# Altium schematic sheet Spanungsversorgung.SchDoc: SysP18_Team10: Spannungsregler
size A4; Author: Michael Alig; CompanyName: NTB; Organization: NTB Interstate University of Applied; Address1: Werdenbergstrasse 4; Address3: 9471 Buchs; Address4: Switzerland; SheetNumber: 2; SheetTotal: 5; Organization1: Sciences of Technology Buchs; Size: A4; ShortDescription: Schema Spannungsregler 3.3V, 5V, 12V
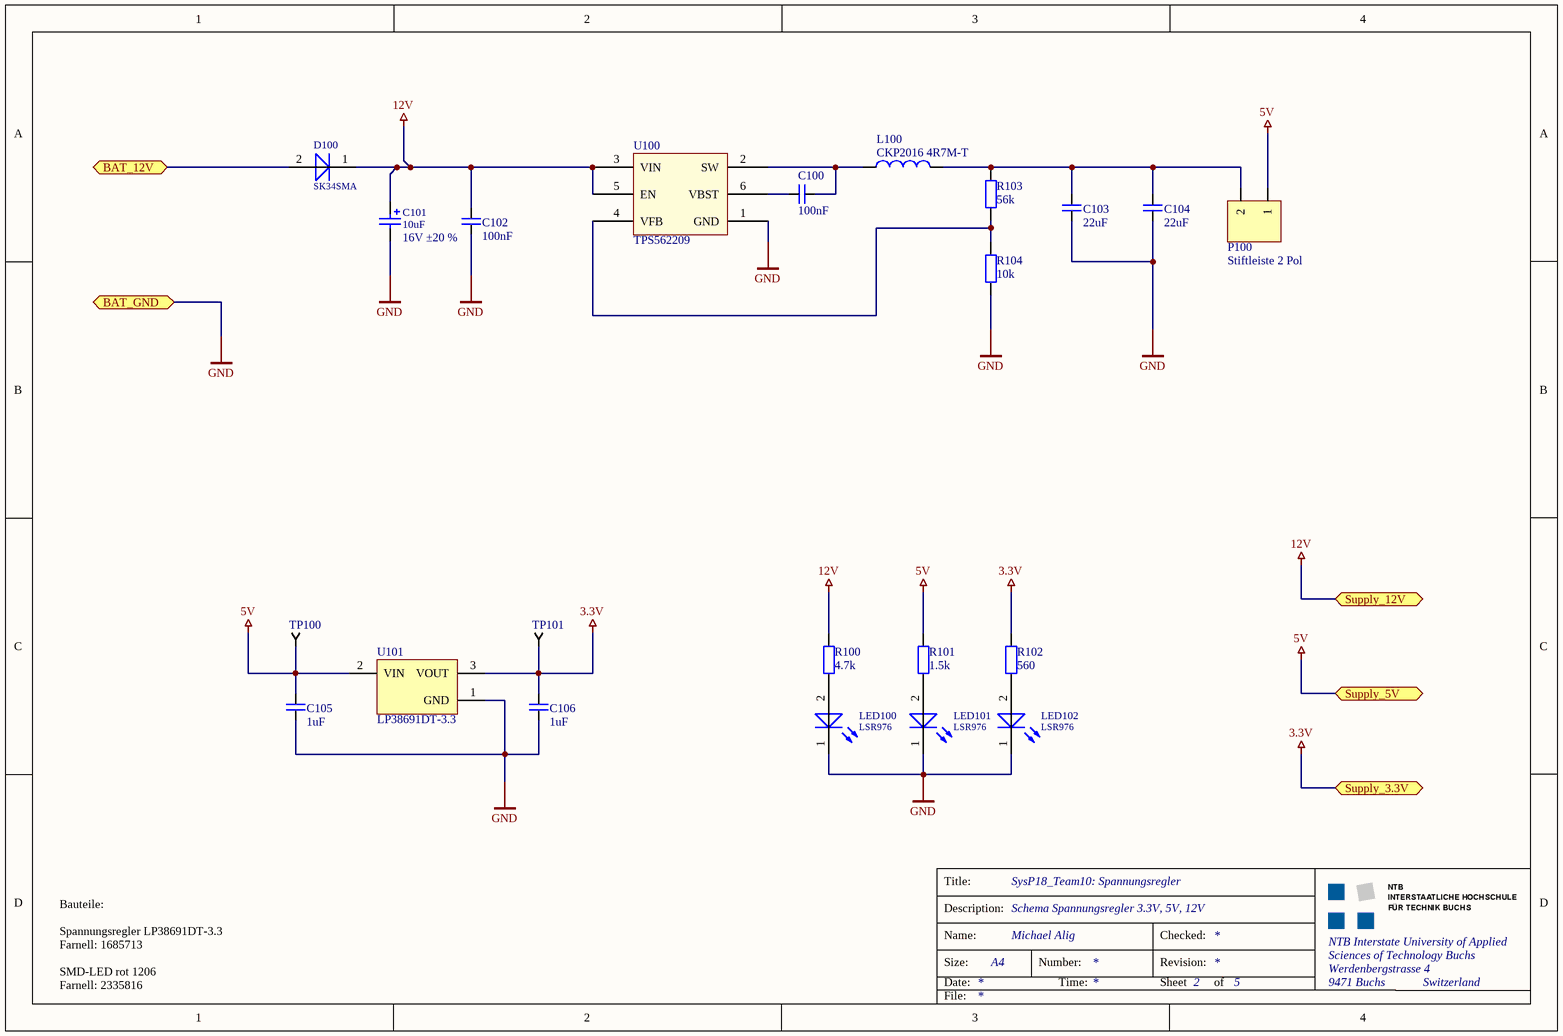
[diagram p0: Spanungsversorgung.SchDoc]

## Parts
C100  100nF  [CAPC0805]
C101  value 10uF  ValueAddon: 16V ±20 %  [CDE_CAP AVE CODE D_H]  (hidden comment: AVE476M16D16T-F)
C102  100nF  [CAPC0805]
C103  22uF  [CAPC1206]
C104  22uF  [CAPC1206]
C105  1uF  [CAPC0805]
C106  1uF  [CAPC0805]
D100  SK34SMA  [DIOTEC_DO-214AC_1K2A_2_H]
L100  CKP2016 4R7M-T  [IND0806]
LED100  LSR976  [CAPC1206]
LED101  LSR976  [CAPC1206]
LED102  LSR976  [CAPC1206]
P100  Stiftleiste 2 Pol  [2Pin Header 2.54mm]
R100  value 4.7k  [GEN_R0805_H]  (hidden comment: Generic)
R101  value 1.5k  [GEN_R0805_H]  (hidden comment: Generic)
R102  value 560  [GEN_R0805_H]  (hidden comment: Generic)
R103  value 56k  [GEN_R0805_H]  (hidden comment: Generic)
R104  value 10k  [GEN_R0805_H]  (hidden comment: Generic)
TP100  Testpoint xSmall  [TP_SMD_xsmall]  (value not drawn)  (no BOM)
TP101  Testpoint xSmall  [TP_SMD_xsmall]  (value not drawn)  (no BOM)
U100  TPS562209  [SOT23-6]
U101  LP38691DT-3.3  [TO-92-TO3]

## Ports
BAT_12V, BAT_GND, Supply_3.3V, Supply_5V, Supply_12V

## Nets
3.3V: C106.1 R102.2 TP101.1 U101.3(VOUT) ; port Supply_3.3V
5V: C105.1 P100.1 R101.2 TP100.1 U101.2(VIN) ; port Supply_5V
12V: C101.1(Pos) C102.1 D100.1(K) R100.2 U100.3(VIN) U100.5(EN) ; port Supply_12V
GND: C101.2(Neg) C102.2 C103.1 C104.2 C105.2 C106.2 LED100.1(K) LED101.1(K) LED102.1(K) R104.1 U100.1(GND) U101.1(GND) ; port BAT_GND
BAT_12V: D100.2(A) ; port BAT_12V
NetC100_1: C100.1 U100.6(VBST)
NetC100_2: C100.2 L100.1 U100.2(SW)
NetC103_2: C103.2 C104.1 L100.2 P100.2 R103.2
NetLED100_2: LED100.2(A) R100.1
NetLED101_2: LED101.2(A) R101.1
NetLED102_2: LED102.2(A) R102.1
NetR103_1: R103.1 R104.2 U100.4(VFB)

## Notes on the sheet
- Bauteile:
  Spannungsregler LP38691DT-3.3
  Farnell: 1685713
  SMD-LED rot 1206
  Farnell: 2335816
- Title:
- Description:
- Size:
- Date:
- Name:
- Number:
- Time:
- Revision:
- Sheet
- Checked:
- of
- File:

## Library data of the parts
C100 C102 C105 C106 = C Bipolar 0805: X7R MLCC 0805 (2012 Metric); Rated Voltage: 50V; Value: 100n; Tolerance: 10%; Case-EIA: 0805; Case-Metric: 2012; Temperature Characteristics EIA: X7R; Temperature Range EIA: -55C/+125C
C101 = CDE_AVE476M16D16T-F_AVE CODE D: Aluminum Electrolytic Capacitors for Filtering and Bypass, 47uF, 16V; Manufacturer: Cornell Dubilier; #Class: PASSIVE; RefFootprint: CDE_CAP AVE CODE D; #ClassSub: CAPACITOR; Distributor PartNr: 598-AVE476M16D16T-F; Distributor: Mouser; Published: 20121220; Publisher: Stefan Ursella, M.Eng; ComponentLink1Description: Manufacturer Link; ComponentLink2Description: Datasheet; ComponentLink2URL: http://www.cde.com/catalogs/AVE.pdf; ComponentLink3Description: Packaging Specification; Manufacturer PartNr: AVE476M16D16T-F; RefFileFOO: *; RefFileSCH: *; RefSchema: CDE_AVE476M16D16T-F_AVE CODE D
C103 C104 = C Bipolar 1206: X7R MLCC 1206 (3016 Metric); Rated Voltage: 10V; Value: 22u; Tolerance: 10%; Case-EIA: 1206; Case-Metric: 3216; Temperature Characteristics EIA: X7R; Temperature Range EIA: -55C/+125C
D100 = DIOTEC_SK34SMA_DO-214AC: Manufacturer: Diotec Semiconductor; #Class: DIODE; #ClassSub: SCHOTTKY; ComponentLink1Description: Manufacturer Link; ComponentLink1URL: http://diotec.com/en/products/all-products/productlist.html?aid=SK34SMA; ComponentLink2Description: Datasheet; ComponentLink2URL: http://diotec.com/tl_files/diotec/files/pdf/datasheets/sk32sma.pdf; ComponentLink3Description: Packaging Specification; ComponentLink3URL: http://diotec.com/en/products/all-products/productlist.html?aid=SK34SMA; Distributor: Distrelec; RefFootprint: DIOTEC_DO-214AC_1K2A_2_H; Manufacturer PartNr: SK34SMA; Distributor PartNr: 600727; Published: 20121217; Publisher: Stefan Ursella, M.Eng; Status: nLager; RefFileFOO: *; RefFileSCH: *; RefSchema: DIOTEC_SK34SMA_DO-214AC
L100 = L: MULTILAYER CHIP POWER INDUCTORS; Manufactor: Taiyo Yuden; Current Rating: 900mA; DCR: 160mOhm; Inductance: 4u7; ComponentLink1Description: Datasheet Taiyo Yuden CK Series; ComponentLink1URL: V:\Inductor\Taiyo_Yuden_CK_Series.pdf
LED100-LED102 = OSR_LSR976_0805(1K2A): Hyper ChipLED, Red,; Manufacturer: OSRAM; #Class: DIODE; #ClassSub: LED; RefFootprint: GEN_LED0805_1K2A_2_H; ComponentLink1Description: Manufacturer Link; ComponentLink1URL: http://www.osram-os.com/osram_os/en/products/product-catalog/led-light-emitting-diodes/chipled/chipled-0805/ls-r976/index.jsp?search_result=%2fosram_os%2fen%2fsearch%2fadvanced_search.jsp%3faction%3ddosearch%26inp_searchterm_1%3dLS%2bR976%26website_name%3dosram_os_en; ComponentLink2Description: Datasheet; ComponentLink2URL: http://catalog.osram-os.com/catalogue/catalogue.do;jsessionid=8A0FA5146E77D3A917A5A5D383CD44B4?act=downloadFile&favOid=0200000600039319000100b6; ComponentLink3Description: Packaging Specification; ComponentLink3URL: http://catalog.osram-os.com/catalogue/catalogue.do;jsessionid=8A0FA5146E77D3A917A5A5D383CD44B4?act=downloadFile&favOid=0200000600039319000100b6; Distributor: Farnell; Manufacturer PartNr: LSR976; Distributor PartNr: 1226392; Published: 20121218; Publisher: Stefan Ursella, M.Eng; RefFileFOO: *; RefFileSCH: *; RefSchema: OSR_LSR976_0805(1K2A)
P100 = 2 Pin Connector
R100-R104 = GEN_R_2: generic resistor; Manufacturer: Tbd; #Class: PASSIVE; Published: 8-Jun-2000; Publisher: Altium Limited; #ClassSub: RESISTOR; ComponentLink1Description: Manufacturer Link; ComponentLink2Description: Datasheet; ComponentLink3Description: Packaging Specification; Distributor: tbd; RefFootprint: GEN_R0805_H; Manufacturer PartNr: tbd; Distributor PartNr: tbd; RefFileFOO: *; RefFileSCH: *; RefSchema: GEN_R_2
TP100 TP101 = Testpoint small: Type: Standard (No BOM)
U100 = TPS562209: 3-A Synchronous Step-Down Voltage Regulator; Manufactor: Texas Instruments; Order Nr.: TPS562209DDCR; ComponentLink1Description: Datasheet TPS56x209; ComponentLink1URL: V:\Power_Management_ICs\PWM_Cont\TPS56x209.pdf
U101 = MCP1700-1202E/TO: Low Quiescent Current LDO, 3-Pin TO-92, Extended TemperatureBAG; Published: 29-Jan-2009; DatasheetVersion: revB, Feb-2007; PackageVersion: revBB, Aug-2009; PackageReference: TO-92-TO3; Publisher: Altium Limited; PackageDescription: 3-Lead Plastic Transistor Outline (TO) [TO-92]; Supplier 1: Digi-Key; Supplier Part Number 1: MCP1700-1202E/TO-ND; ComponentLink1Description: Datasheet; ComponentLink1URL: http://ww1.microchip.com/downloads/en/DeviceDoc/21826b.pdf; ComponentLink2Description: Packaging Specification; ComponentLink2URL: http://www.microchip.com/stellent/groups/techpub_sg/documents/packagingspec/en012702.pdf; ComponentLink3Description: Microchip.com Home; ComponentLink3URL: http://www.microchip.com/